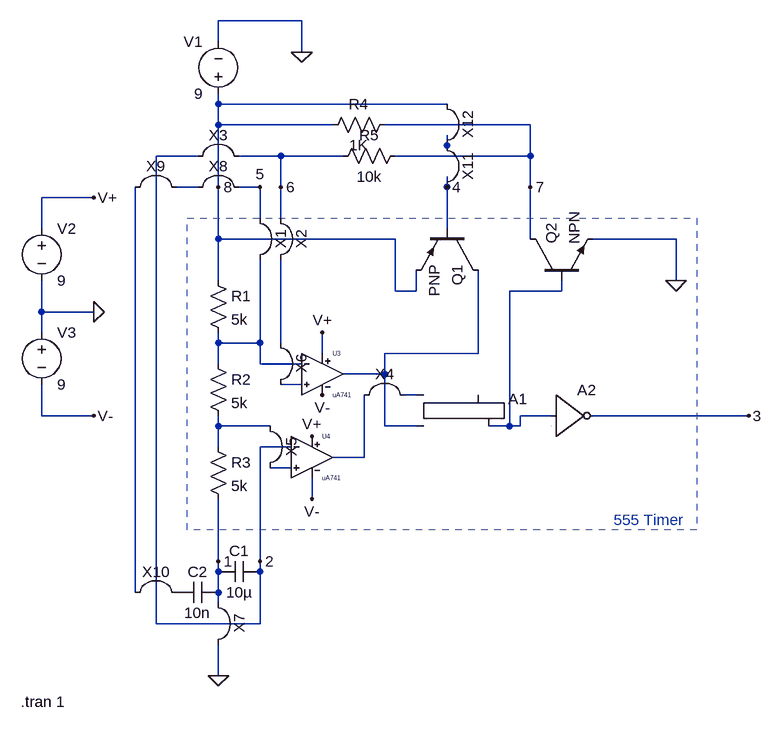
[diagram p0: schematic IC555.asc]
IC555.asc, the LTspice schematic file:
Version 4
SHEET 1 880 708
WIRE 128 -400 0 -400
WIRE 0 -368 0 -400
WIRE 128 -352 128 -400
WIRE 0 -272 0 -288
WIRE 352 -272 0 -272
WIRE 0 -240 0 -272
WIRE 176 -240 0 -240
WIRE 480 -240 256 -240
WIRE 352 -208 352 -224
WIRE -32 -192 -96 -192
WIRE 96 -192 32 -192
WIRE 192 -192 96 -192
WIRE 480 -192 480 -240
WIRE 480 -192 272 -192
WIRE -32 -144 -64 -144
WIRE 0 -144 0 -240
WIRE 64 -144 32 -144
WIRE 96 -144 96 -192
WIRE 352 -144 352 -160
WIRE 480 -144 480 -192
WIRE -192 -128 -272 -128
WIRE 64 -96 64 -144
WIRE 96 -96 96 -144
WIRE -272 -80 -272 -128
WIRE 352 -80 352 -144
WIRE 0 -64 0 -144
WIRE 272 -64 0 -64
WIRE 480 -64 480 -144
WIRE 704 -64 576 -64
WIRE 0 0 0 -64
WIRE 704 0 704 -64
WIRE 272 16 272 -64
WIRE 304 16 304 -16
WIRE 304 16 272 16
WIRE 528 16 528 0
WIRE 528 16 448 16
WIRE -272 48 -272 0
WIRE -192 48 -272 48
WIRE -272 80 -272 48
WIRE 0 96 0 80
WIRE 64 96 64 -32
WIRE 64 96 0 96
WIRE 96 96 96 -32
WIRE 160 112 160 80
WIRE 400 112 400 -16
WIRE 400 112 256 112
WIRE 0 128 0 96
WIRE 64 128 64 96
WIRE 128 128 64 128
WIRE 256 144 256 112
WIRE 256 144 192 144
WIRE 128 160 96 160
WIRE 304 176 288 176
WIRE -272 208 -272 160
WIRE -192 208 -272 208
WIRE 512 208 464 208
WIRE 816 208 576 208
WIRE 0 224 0 208
WIRE 80 224 0 224
WIRE 256 224 256 144
WIRE 304 224 256 224
WIRE 448 224 448 16
WIRE 448 224 416 224
WIRE 464 224 464 208
WIRE 464 224 448 224
WIRE 0 256 0 224
WIRE 112 256 64 256
WIRE 224 272 224 176
WIRE 224 272 176 272
WIRE 112 288 80 288
WIRE 144 336 144 304
WIRE 0 432 0 336
WIRE 64 432 64 256
WIRE 0 448 0 432
WIRE 64 448 64 432
WIRE -128 480 -128 -144
WIRE 0 480 0 448
WIRE 0 496 0 480
WIRE -96 528 -96 -192
WIRE 64 528 64 448
WIRE 64 528 -96 528
WIRE 0 608 0 560
FLAG -192 48 0
FLAG -192 -128 V+
FLAG -192 208 V-
FLAG 160 80 V+
FLAG 144 240 V+
FLAG 144 336 V-
FLAG 704 0 0
FLAG 160 176 V-
FLAG 0 -144 8
FLAG 352 -144 4
FLAG 480 -144 7
FLAG 816 208 3
FLAG 64 432 2
FLAG 0 432 1
FLAG 64 -144 5
FLAG 96 -144 6
FLAG 128 -352 0
FLAG 0 608 0
SYMBOL Digital\\srflop 352 128 R0
SYMATTR InstName A1
SYMBOL Digital\\inv 512 144 R0
SYMATTR InstName A2
SYMBOL res -16 -16 R0
SYMATTR InstName R1
SYMATTR Value 5k
SYMBOL res -16 112 R0
SYMATTR InstName R2
SYMATTR Value 5k
SYMBOL res -16 240 R0
SYMATTR InstName R3
SYMATTR Value 5k
SYMBOL voltage -272 -96 R0
WINDOW 123 0 0 Left 0
WINDOW 39 0 0 Left 0
SYMATTR InstName V2
SYMATTR Value 9
SYMBOL voltage -272 64 R0
WINDOW 123 0 0 Left 0
WINDOW 39 0 0 Left 0
SYMATTR InstName V3
SYMATTR Value 9
SYMBOL pnp 400 -80 R90
SYMATTR InstName Q1
SYMBOL npn 480 0 R270
SYMATTR InstName Q2
SYMBOL Misc\\jumper 256 112 R0
SYMATTR InstName X4
SYMBOL Misc\\jumper 144 256 R90
SYMATTR InstName X5
SYMBOL Misc\\jumper 160 128 R90
SYMATTR InstName X6
SYMBOL Misc\\jumper 128 -64 R90
SYMATTR InstName X1
SYMBOL Misc\\jumper 160 -64 R90
SYMATTR InstName X2
SYMBOL res 272 -256 R90
WINDOW 0 0 56 VBottom 2
WINDOW 3 32 56 VTop 2
SYMATTR InstName R4
SYMATTR Value 1K
SYMATTR SpiceLine tol=1 pwr=0.1
SYMBOL res 288 -208 R90
WINDOW 0 0 56 VBottom 2
WINDOW 3 32 56 VTop 2
SYMATTR InstName R5
SYMATTR Value 10k
SYMBOL Misc\\jumper 0 -256 R0
SYMATTR InstName X3
SYMBOL Misc\\jumper 64 528 R90
SYMATTR InstName X7
SYMBOL cap 64 432 R90
WINDOW 0 0 32 VBottom 2
WINDOW 3 32 32 VTop 2
SYMATTR InstName C1
SYMATTR Value 10µ
SYMBOL Misc\\jumper 0 -208 R0
SYMATTR InstName X8
SYMBOL Misc\\jumper -96 -208 R0
SYMATTR InstName X9
SYMBOL Misc\\jumper -96 416 R0
SYMATTR InstName X10
SYMBOL cap 0 464 R90
WINDOW 0 0 32 VBottom 2
WINDOW 3 32 32 VTop 2
SYMATTR InstName C2
SYMATTR Value 10n
SYMBOL Misc\\jumper 416 -176 R90
SYMATTR InstName X11
SYMBOL Misc\\jumper 416 -240 R90
SYMATTR InstName X12
SYMBOL uA741 160 80 R0
SYMATTR InstName U3
SYMBOL uA741 144 208 R0
SYMATTR InstName U4
SYMBOL voltage 0 -272 R180
WINDOW 0 24 96 Left 2
WINDOW 3 24 16 Left 2
WINDOW 123 0 0 Left 0
WINDOW 39 0 0 Left 0
SYMATTR InstName V1
SYMATTR Value 9
TEXT -304 648 Left 2 !.tran 1
TEXT 608 368 Left 2 ;555 Timer
RECTANGLE Normal 736 384 -48 -96 2

The netlist it stands for:
* IC555.asc
A1 N003 N002 0 0 0 N001 0 0 SRFLOP
A2 N001 0 0 0 0 3 0 0 BUF
R1 4 5 5k
R2 5 N004 5k
R3 N004 0 5k
V2 V+ 0 9
V3 0 V- 9
Q1 N002 4 4 0 PNP
Q2 7 N001 0 0 NPN
R4 7 4 1K tol=1 pwr=0.1
R5 7 6 10k
C1 6 0 10µ
C2 0 5 10n
XU3 6 5 V+ V- N002 uA741  ; pins In+ In- V+ V- OUT
XU4 N004 6 V+ V- N003 uA741  ; pins In+ In- V+ V- OUT
V1 4 0 9
.model NPN NPN
.model PNP PNP
.lib standard.bjt
.tran 1
* 555 Timer
.lib OpAmp.lib
.backanno
.end